# Altium schematic sheet RD15002SCT_Collection.SchDoc
size A4
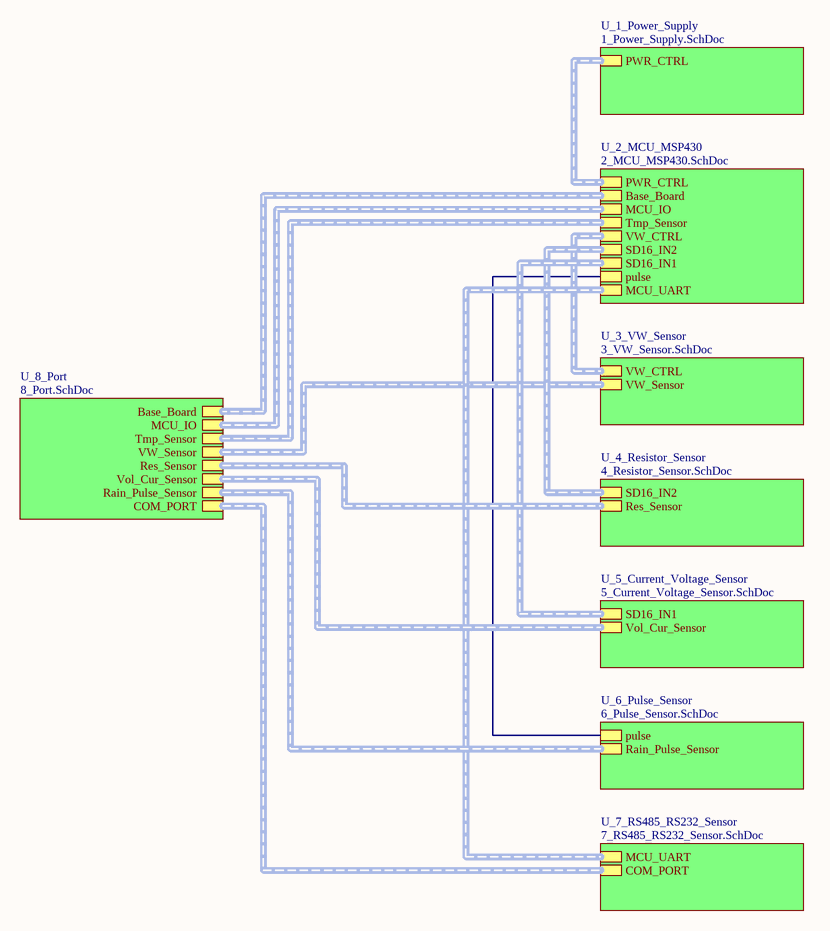
[diagram p0: RD15002SCT_Collection.SchDoc]

## Sub-sheets
U_1_Power_Supply = 1_Power_Supply.SchDoc: PWR_CTRL (harness PWR_CTRL)
U_2_MCU_MSP430 = 2_MCU_MSP430.SchDoc: MCU_UART (harness MCU_UART), PWR_CTRL (harness PWR_CTRL), SD16_IN1 (harness SD16_IN1), SD16_IN2 (harness SD16_IN2), pulse, Tmp_Sensor (harness Tmp_Sensor), VW_CTRL (harness VW_CTRL), MCU_IO (harness MCU_IO), Base_Board (harness Base_Board)
U_3_VW_Sensor = 3_VW_Sensor.SchDoc: VW_CTRL (harness VW_CTRL), VW_Sensor (harness VW_Sensor)
U_4_Resistor_Sensor = 4_Resistor_Sensor.SchDoc: SD16_IN2 (harness SD16_IN2), Res_Sensor (harness Res_Sensor)
U_5_Current_Voltage_Sensor = 5_Current_Voltage_Sensor.SchDoc: SD16_IN1 (harness SD16_IN1), Vol_Cur_Sensor (harness Vol_Cur_Sensor)
U_6_Pulse_Sensor = 6_Pulse_Sensor.SchDoc: pulse, Rain_Pulse_Sensor (harness Rain_Pulse_Sensor)
U_7_RS485_RS232_Sensor = 7_RS485_RS232_Sensor.SchDoc: COM_PORT (harness COM_PORT), MCU_UART (harness MCU_UART)
U_8_Port = 8_Port.SchDoc: Rain_Pulse_Sensor (harness Rain_Pulse_Sensor), VW_Sensor (harness VW_Sensor), Vol_Cur_Sensor (harness Vol_Cur_Sensor), Tmp_Sensor (harness Tmp_Sensor), Res_Sensor (harness Res_Sensor), COM_PORT (harness COM_PORT), MCU_IO (harness MCU_IO), Base_Board (harness Base_Board)

## Nets
(unnamed): sheet U_6_Pulse_Sensor/pulse, sheet U_2_MCU_MSP430/pulse

## Buses and harness runs
harness sheet U_1_Power_Supply/PWR_CTRL = sheet U_2_MCU_MSP430/PWR_CTRL
harness sheet U_2_MCU_MSP430/Base_Board = sheet U_8_Port/Base_Board
harness sheet U_2_MCU_MSP430/MCU_IO = sheet U_8_Port/MCU_IO
harness sheet U_2_MCU_MSP430/MCU_UART = sheet U_7_RS485_RS232_Sensor/MCU_UART
harness sheet U_2_MCU_MSP430/SD16_IN1 = sheet U_5_Current_Voltage_Sensor/SD16_IN1
harness sheet U_2_MCU_MSP430/SD16_IN2 = sheet U_4_Resistor_Sensor/SD16_IN2
harness sheet U_2_MCU_MSP430/Tmp_Sensor = sheet U_8_Port/Tmp_Sensor
harness sheet U_2_MCU_MSP430/VW_CTRL = sheet U_3_VW_Sensor/VW_CTRL
harness sheet U_3_VW_Sensor/VW_Sensor = sheet U_8_Port/VW_Sensor
harness sheet U_4_Resistor_Sensor/Res_Sensor = sheet U_8_Port/Res_Sensor
harness sheet U_5_Current_Voltage_Sensor/Vol_Cur_Sensor = sheet U_8_Port/Vol_Cur_Sensor
harness sheet U_6_Pulse_Sensor/Rain_Pulse_Sensor = sheet U_8_Port/Rain_Pulse_Sensor
harness sheet U_7_RS485_RS232_Sensor/COM_PORT = sheet U_8_Port/COM_PORT

## Notes on the sheet
- 文件版本:
- 原理图名:
- 工 程  名:
- 绘       制:
- 审       核:
- 第   页，共    页
- 日       期: